# EAGLE design base_unit_pcb_v1 (EAGLE 9.6.2)
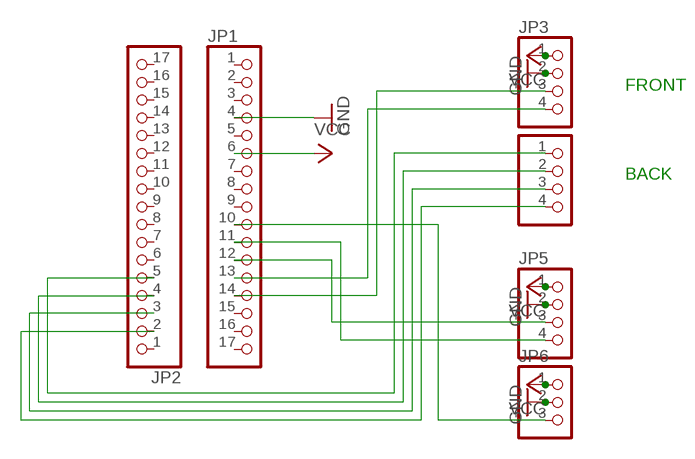
[diagram p0: schematic, sheet 1]

## Parts
JP1  PINHD-1X17  [1X17]
JP2  PINHD-1X17  [1X17]
JP3  PINHD-1X4  [1X04]
JP4  PINHD-1X4  [1X04]
JP5  PINHD-1X4  [1X04]
JP6  PINHD-1X3  [1X03]

## Nets
GND: JP1.4 JP3.2 JP5.2 JP6.2
N$1: JP1.12 JP5.3
N$2: JP1.11 JP5.4
N$3: JP1.14 JP3.3
N$4: JP1.13 JP3.4
N$5: JP2.5 JP4.1
N$6: JP2.4 JP4.2
N$7: JP2.3 JP4.3
N$8: JP2.2 JP4.4
N$9: JP1.10 JP6.3
VCC: JP1.6 JP3.1 JP5.1 JP6.1
Unconnected: JP1.1 JP1.2 JP1.3 JP1.5 JP1.7 JP1.8 JP1.9 JP1.15 JP1.16 JP1.17 JP2.1 JP2.6 JP2.7 JP2.8 JP2.9 JP2.10 JP2.11 JP2.12 JP2.13 JP2.14 JP2.15 JP2.16 JP2.17

## Notes on the sheet
- FRONT
- BACK

## Library data of the parts
JP1 JP2 = pinhead:PINHD-1X17: PIN HEADER
JP3-JP5 = pinhead:PINHD-1X4: PIN HEADER
JP6 = pinhead:PINHD-1X3: PIN HEADER

## Board
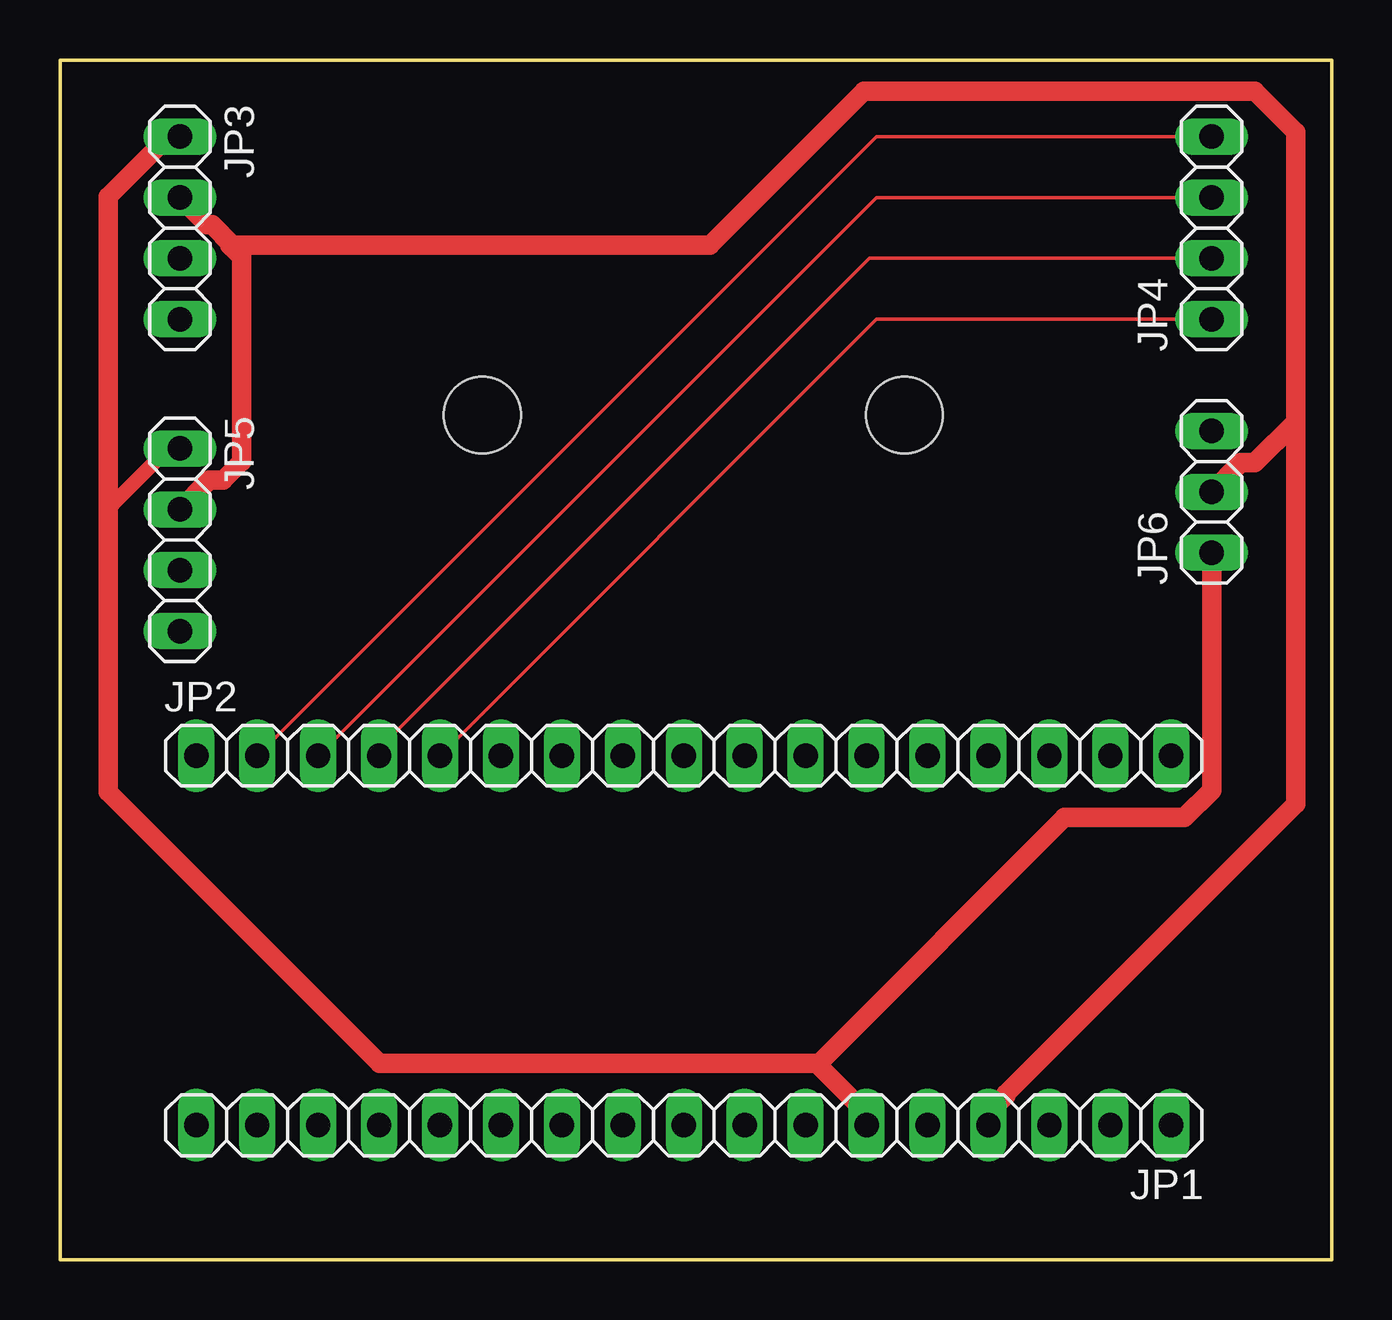
[diagram p1: board, top side]
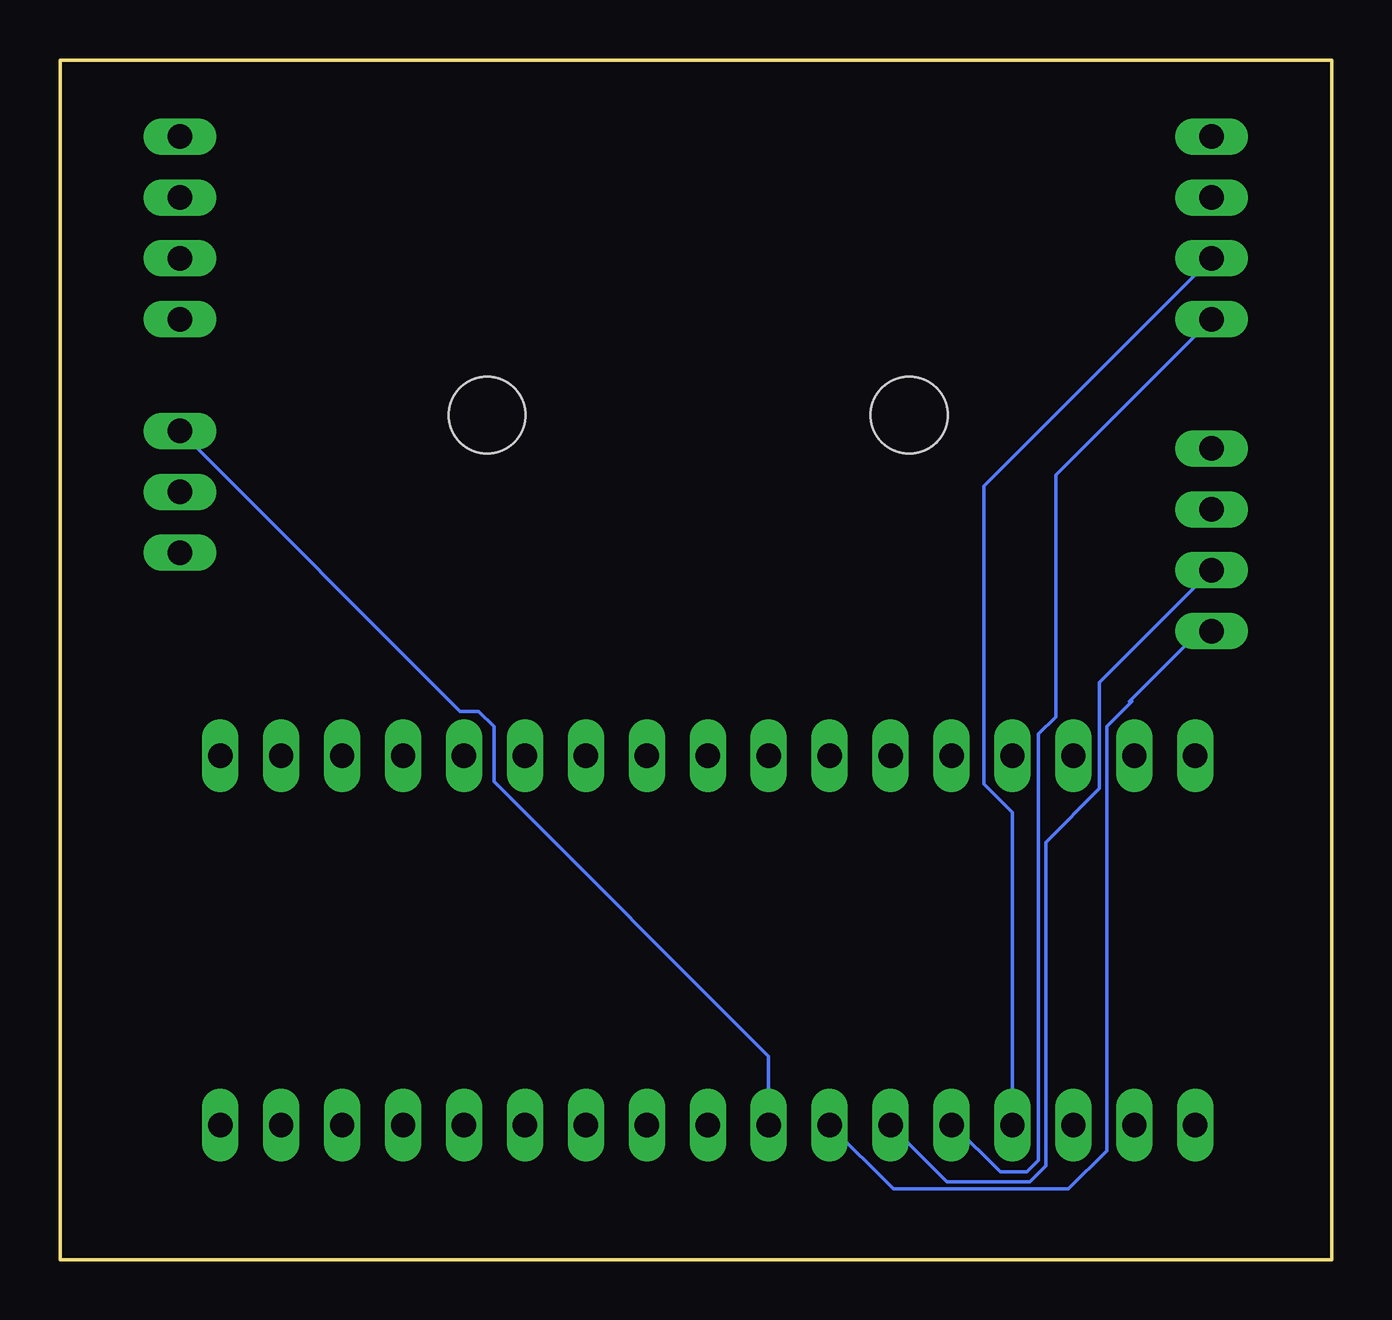
[diagram p2: board, bottom side, seen from below]

Size 53 x 50 mm. Coordinates in mm from the lower left corner, seen from the top.
Outline: 0,0 53,0 53,50 0,50 0,0
Copper layers (1*16): Top 0.035mm / dielectric 1.53mm / Bottom 0.035mm
Design rules "pban_5mil-l2": minimum track width 5mil, minimum drill 0.3mm, track to track 5mil, track to pad 0.229mm, pad to pad 5mil, via to via 5mil, smd to smd 5mil, copper to edge 0.5mm, drill to drill 0.5mm, minimum pad ring 0.15mm, minimum via ring 0.15mm, stop-mask expansion 4mil, vias tented up to drill 0.35mm, thermal gap 10mil
Holes 3.2 mm at 17.6,35.2 35.2,35.2

### Footprints (pad centres in the part's own frame; a part is rotated, then mirrored left to right if it is on the bottom)
1X17 = drill 1.016 long: 1 -20.32,0; 2 -17.78,0; 3 -15.24,0; 4 -12.7,0; 5 -10.16,0; 6 -7.62,0; 7 -5.08,0; 8 -2.54,0; 9 0,0; 10 2.54,0; 11 5.08,0; 12 7.62,0; 13 10.16,0; 14 12.7,0; 15 15.24,0; 16 17.78,0; 17 20.32,0
1X04 = drill 1.016 long: 1 -3.81,0; 2 -1.27,0; 3 1.27,0; 4 3.81,0
1X03 = drill 1.016 long: 1 -2.54,0; 2 0,0; 3 2.54,0

### Placement (x,y rotation side)
JP1  26,5.6 180 top
JP2  26,21 0 top
JP3  5,43 270 top
JP4  48,43 90 top
JP5  5,30 270 top
JP6  48,32 90 top

### Tracks (layer width: path | path; a pad name or v marks a point on that pad's centre or on a via)
GND
  Top 0.813: 7.16,42.2 7.08,42.28 27.1,42.28 33.51,48.69 49.81,48.69 51.5,47 51.5,34.91 | JP5.2 6.22,32.49 6.81,32.49 7.58,33.26 7.58,41.78 7.16,42.2 | JP6.2 49.22,33.22 49.81,33.22 51.5,34.91 | JP1.4 38.7,6.1 39.42,6.82 39.42,6.91 51.5,18.99 51.5,34.91 | JP3.2 6.14,43.13 6.34,43.13 7.16,42.31 7.16,42.2
N$1
  Bottom 0.152: JP5.3 9.67,24.06 9.67,19.63 11.9,17.39 11.9,3.9 12.56,3.24 16.02,3.24 JP1.12
N$2
  Bottom 0.152: JP5.4 5.5,26.19 8.44,23.25 8.33,23.25 9.37,22.22 9.37,4.53 10.96,2.94 18.26,2.94 JP1.11
N$3
  Bottom 0.152: JP1.14 13.3,18.64 14.49,19.83 14.49,32.24 JP3.3
N$4
  Bottom 0.152: JP3.4 11.5,32.69 11.5,22.62 12.21,21.91 12.21,4.13 12.69,3.65 13.81,3.65 15.76,5.6 JP1.13
N$5
  Top 0.152: JP2.5 34.03,39.19 JP4.1
N$6
  Top 0.152: JP4.2 33.73,41.73 13.3,21.3 JP2.4
N$7
  Top 0.152: JP2.3 34.03,44.27 JP4.3
N$8
  Top 0.152: JP4.4 34.03,46.81 JP2.2
N$9
  Bottom 0.152: JP6.3 36.31,22.85 35.55,22.85 34.91,22.21 34.91,19.93 23.46,8.48 JP1.10
VCC
  Top 0.61: 2,31.5 2.19,31.5 4.5,33.81 JP5.1
  Top 0.813: JP3.1 4.5,46.81 2,44.31 2,31.5 | 2,31.5 2,19.5 13.32,8.18 31.54,8.18 33.62,6.1 JP1.6 | 2.1,31.5 2,31.5 | 31.63,8.18 41.86,18.42 46.87,18.42 48,19.55 JP6.1